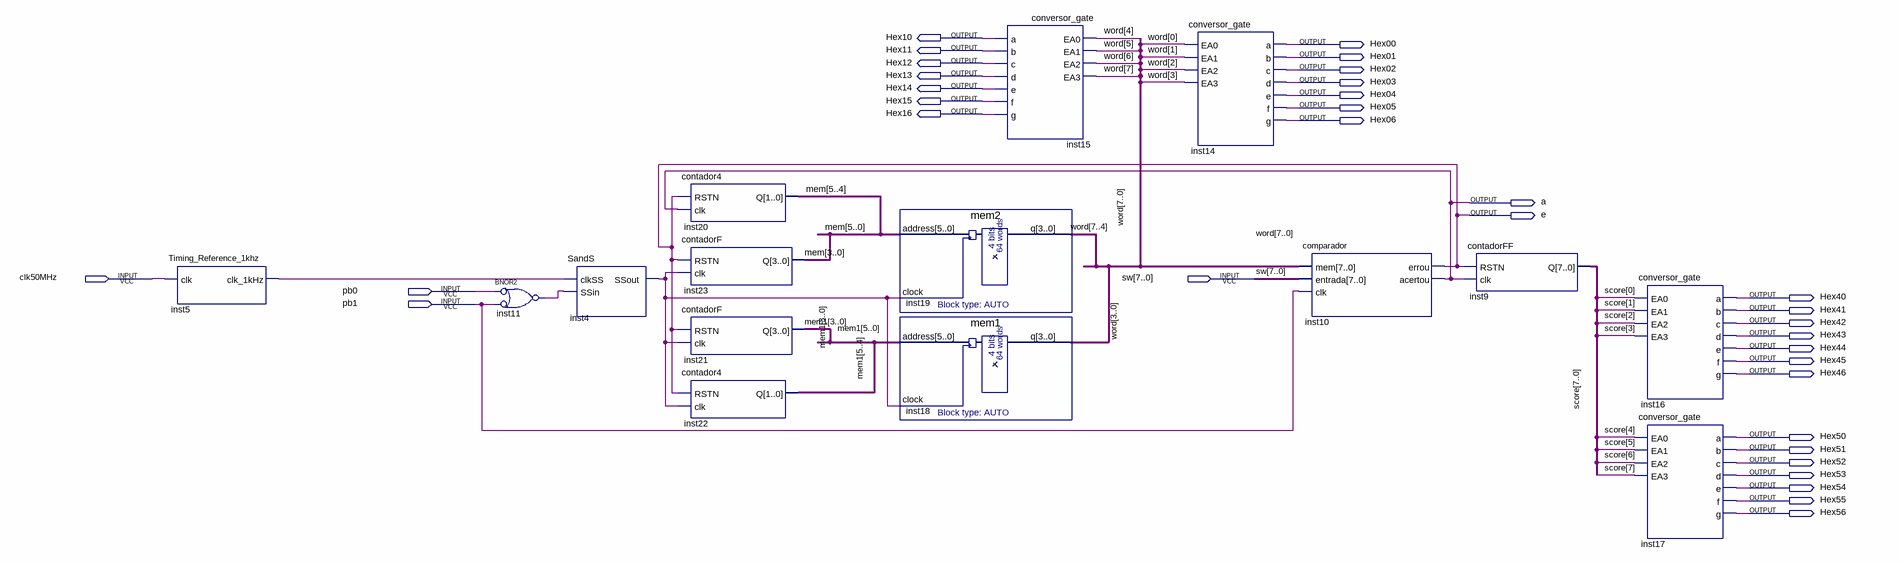
[diagram p0: schematic sheet]
// Quartus schematic Jogo_memoria.bdf as structural Verilog: 15 symbols, 34 pins
module Jogo_memoria (
  input  clk50MHz,
  input  [7:0] sw,
  input  pb0,
  input  pb1,
  output Hex10,
  output Hex00,
  output Hex11,
  output Hex01,
  output Hex12,
  output Hex02,
  output Hex13,
  output Hex03,
  output Hex14,
  output Hex04,
  output Hex15,
  output Hex05,
  output Hex16,
  output Hex06,
  output a,
  output e,
  output Hex40,
  output Hex41,
  output Hex42,
  output Hex43,
  output Hex44,
  output Hex45,
  output Hex46,
  output Hex50,
  output Hex51,
  output Hex52,
  output Hex53,
  output Hex54,
  output Hex55,
  output Hex56
);

  wire inst4_ssout, inst5_clk_1khz, inst11_out;
  wire [5:0] mem, mem1;
  wire [7:0] score, word;

  Timing_Reference_1khz inst5 (.clk(clk50MHz), .clk_1kHz(inst5_clk_1khz));
  nor inst11 (inst11_out, ~pb0, ~pb1);  // BNOR2
  SandS inst4 (.clkSS(inst5_clk_1khz), .SSin(inst11_out), .SSout(inst4_ssout));
  contador4 inst20 (.RSTN(e), .clk(a), .Q(mem[5:4]));
  contadorF inst23 (.RSTN(e), .clk(inst4_ssout), .Q(mem[3:0]));
  contadorF inst21 (.RSTN(e), .clk(inst4_ssout), .Q(mem1[3:0]));
  contador4 inst22 (.RSTN(e), .clk(inst4_ssout), .Q(mem1[5:4]));
  mem2 inst19 (.address(mem), .clock(inst4_ssout), .q(word[7:4]));
  mem1 inst18 (.address(mem1), .clock(inst4_ssout), .q(word[3:0]));
  conversor_gate inst15 (
    .EA0(word[4]), .EA1(word[5]), .EA2(word[6]), .EA3(word[7]), .a(Hex10), .b(Hex11), .c(Hex12), .d(Hex13),
    .e(Hex14), .f(Hex15), .g(Hex16));
  conversor_gate inst14 (
    .EA0(word[0]), .EA1(word[1]), .EA2(word[2]), .EA3(word[3]), .a(Hex00), .b(Hex01), .c(Hex02), .d(Hex03),
    .e(Hex04), .f(Hex05), .g(Hex06));
  comparador inst10 (.mem(word), .entrada(sw), .clk(pb1), .errou(e), .acertou(a));
  contadorFF inst9 (.RSTN(e), .clk(a), .Q(score));
  conversor_gate inst16 (
    .EA0(score[0]), .EA1(score[1]), .EA2(score[2]), .EA3(score[3]), .a(Hex40), .b(Hex41), .c(Hex42),
    .d(Hex43), .e(Hex44), .f(Hex45), .g(Hex46));
  conversor_gate inst17 (
    .EA0(score[4]), .EA1(score[5]), .EA2(score[6]), .EA3(score[7]), .a(Hex50), .b(Hex51), .c(Hex52),
    .d(Hex53), .e(Hex54), .f(Hex55), .g(Hex56));
endmodule
